# Altium schematic sheet Mechanics.SchDoc
size A3; SheetNumber: 1; SheetTotal: 1; PageSetup: Record=PageOptions|CenterHorizontal=True|CenterVertical=True|PrintScale=0.97|XCorrection=1.00|YCorrection=1.00|PrintKind=1|BorderSize=5000000|LeftOffset=0|BottomOffset=0|Orientation=2|PaperLength=2970|PaperWidth=2100|Scale=100|PaperSource=7|PrintQuality=600|MediaType=1|DitherType=10|PaperKind=A4|PrintScaleMode=1
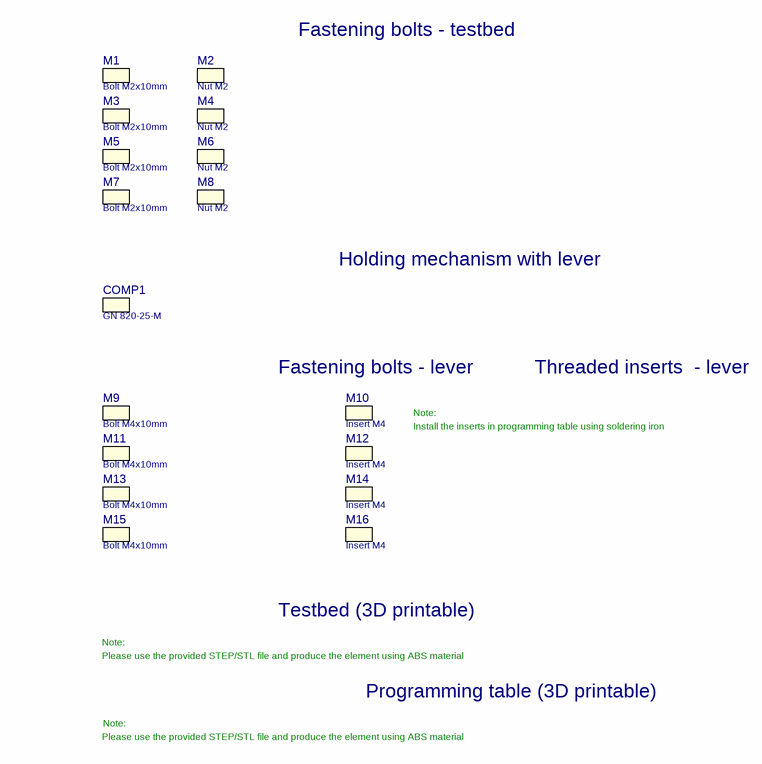
[diagram p0: Mechanics.SchDoc]

## Parts
COMP1  GN 820-25-M  (mechanical)
M1  Bolt M2x10mm  (mechanical)
M2  Nut M2  (mechanical)
M3  Bolt M2x10mm  (mechanical)
M4  Nut M2  (mechanical)
M5  Bolt M2x10mm  (mechanical)
M6  Nut M2  (mechanical)
M7  Bolt M2x10mm  (mechanical)
M8  Nut M2  (mechanical)
M9  Bolt M4x10mm  (mechanical)
M10  Insert M4  (mechanical)
M11  Bolt M4x10mm  (mechanical)
M12  Insert M4  (mechanical)
M13  Bolt M4x10mm  (mechanical)
M14  Insert M4  (mechanical)
M15  Bolt M4x10mm  (mechanical)
M16  Insert M4  (mechanical)

## Notes on the sheet
- Fastening bolts - testbed
- Holding mechanism with lever
- Fastening bolts - lever
- Install the inserts in programming table using soldering iron
- Note:
- (near M10) Threaded inserts  - lever
- Testbed (3D printable)
- Please use the provided STEP/STL file and produce the element using ABS material
- Programming table (3D printable)
- Title:
- Size:
- Date:
- A3
- Revision:
- Page:
- of
- Antmicro Ltd.
- File:
- www.antmicro.com

## Library data of the parts
COMP1 = GENERIC_BOM_ONLY: Manufacturer: ELESA+GANTER; PartNumber: GN 820-25-M; PartSymbol: GN 820-25-M; Value: GN 820-25-M
M1 M3 M5 M7 = GENERIC_BOM_ONLY: Bolt M4x10mm; Manufacturer: BOSSARD; PartNumber: M2X10/BN1435; Value: Bolt M2x10mm; PartSymbol: Bolt M2x10mm
M2 M4 M6 M8 = GENERIC_BOM_ONLY: Bolt M4x10mm; Manufacturer: BOSSARD; PartNumber: M2/BN109; Value: Nut M2; PartSymbol: Nut M2
M9 M11 M13 M15 = GENERIC_BOM_ONLY: Manufacturer: BOSSARD; PartNumber: M4X10/BN1435 SN213306; Value: Bolt M4x10mm; PartSymbol: Bolt M4x10mm
M10 M12 M14 M16 = GENERIC_BOM_ONLY: Bolt M4x10mm; Manufacturer: BOSSARD; PartNumber: M4/BN1052; Value: Insert M4; PartSymbol: Insert M4